# Altium schematic sheet TP_IHM_MAIN.SchDoc
size A4
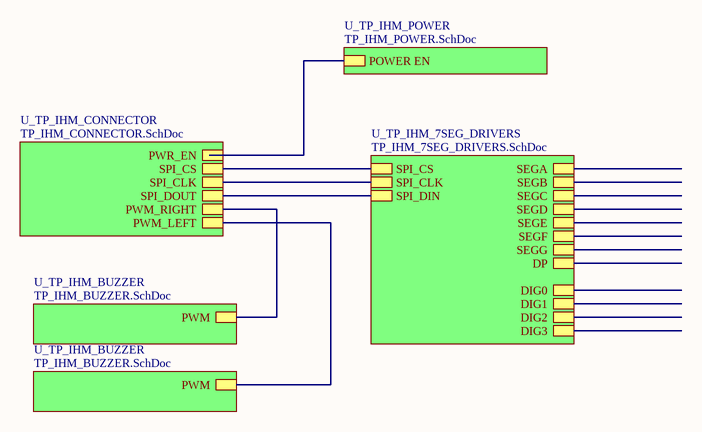
[diagram p0: TP_IHM_MAIN.SchDoc]

## Sub-sheets
U_TP_IHM_7SEG_DRIVERS = TP_IHM_7SEG_DRIVERS.SchDoc: SPI_CS, SPI_CLK, SPI_DIN, SEGA, SEGB, SEGC, SEGD, SEGE, SEGF, SEGG, DP, DIG0, DIG1, DIG2, DIG3
U_TP_IHM_BUZZER = TP_IHM_BUZZER.SchDoc: PWM
U_TP_IHM_BUZZER = TP_IHM_BUZZER.SchDoc: PWM
U_TP_IHM_CONNECTOR = TP_IHM_CONNECTOR.SchDoc: PWR_EN, SPI_CLK, SPI_DOUT, PWM_RIGHT, SPI_CS, PWM_LEFT
U_TP_IHM_POWER = TP_IHM_POWER.SchDoc: POWER EN

## Nets
(unnamed): sheet U_TP_IHM_CONNECTOR/PWR_EN, sheet U_TP_IHM_POWER/POWER EN
(unnamed): sheet U_TP_IHM_CONNECTOR/SPI_CLK, sheet U_TP_IHM_7SEG_DRIVERS/SPI_CLK
(unnamed): sheet U_TP_IHM_CONNECTOR/SPI_DOUT, sheet U_TP_IHM_7SEG_DRIVERS/SPI_DIN
(unnamed): sheet U_TP_IHM_CONNECTOR/PWM_RIGHT, sheet U_TP_IHM_BUZZER/PWM
(unnamed): sheet U_TP_IHM_CONNECTOR/SPI_CS, sheet U_TP_IHM_7SEG_DRIVERS/SPI_CS
(unnamed): sheet U_TP_IHM_CONNECTOR/PWM_LEFT, sheet U_TP_IHM_BUZZER/PWM